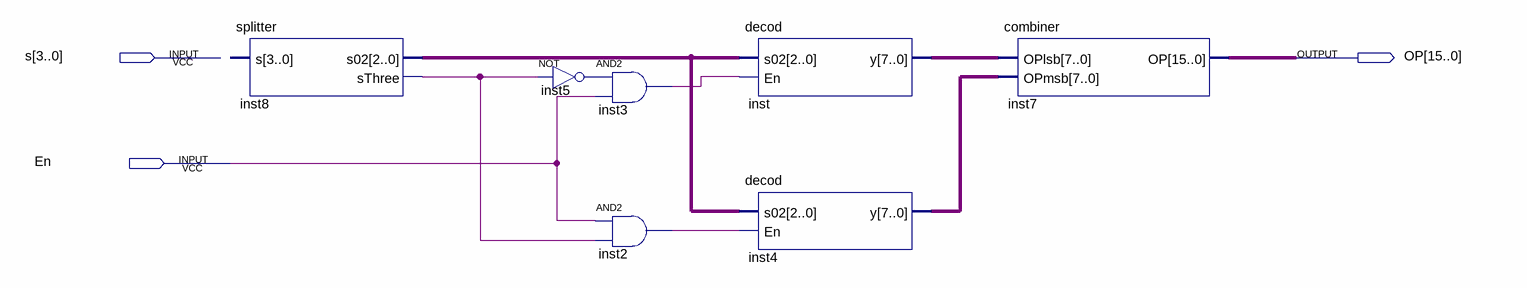
[diagram p0: schematic sheet]
// Quartus schematic 4to16.bdf as structural Verilog: 7 symbols, 3 pins
module \4to16  (
  input  [3:0] s,
  input  En,
  output [15:0] OP
);

  wire inst2_out, inst3_out, inst5_out, inst8_sthree;
  wire [2:0] inst8_s02;
  wire [7:0] inst4_y, inst_y;

  splitter inst8 (.s02(inst8_s02), .sThree(inst8_sthree));  // open: s
  and inst3 (inst3_out, inst5_out, En);
  not inst5 (inst5_out, inst8_sthree);
  and inst2 (inst2_out, En, inst8_sthree);
  decod inst (.s02(inst8_s02), .En(inst3_out), .y(inst_y));
  decod inst4 (.s02(inst8_s02), .En(inst2_out), .y(inst4_y));
  combiner inst7 (.OPlsb(inst_y), .OPmsb(inst4_y), .OP(OP));
endmodule
